# Altium schematic sheet H-Link.SchDoc
size A4
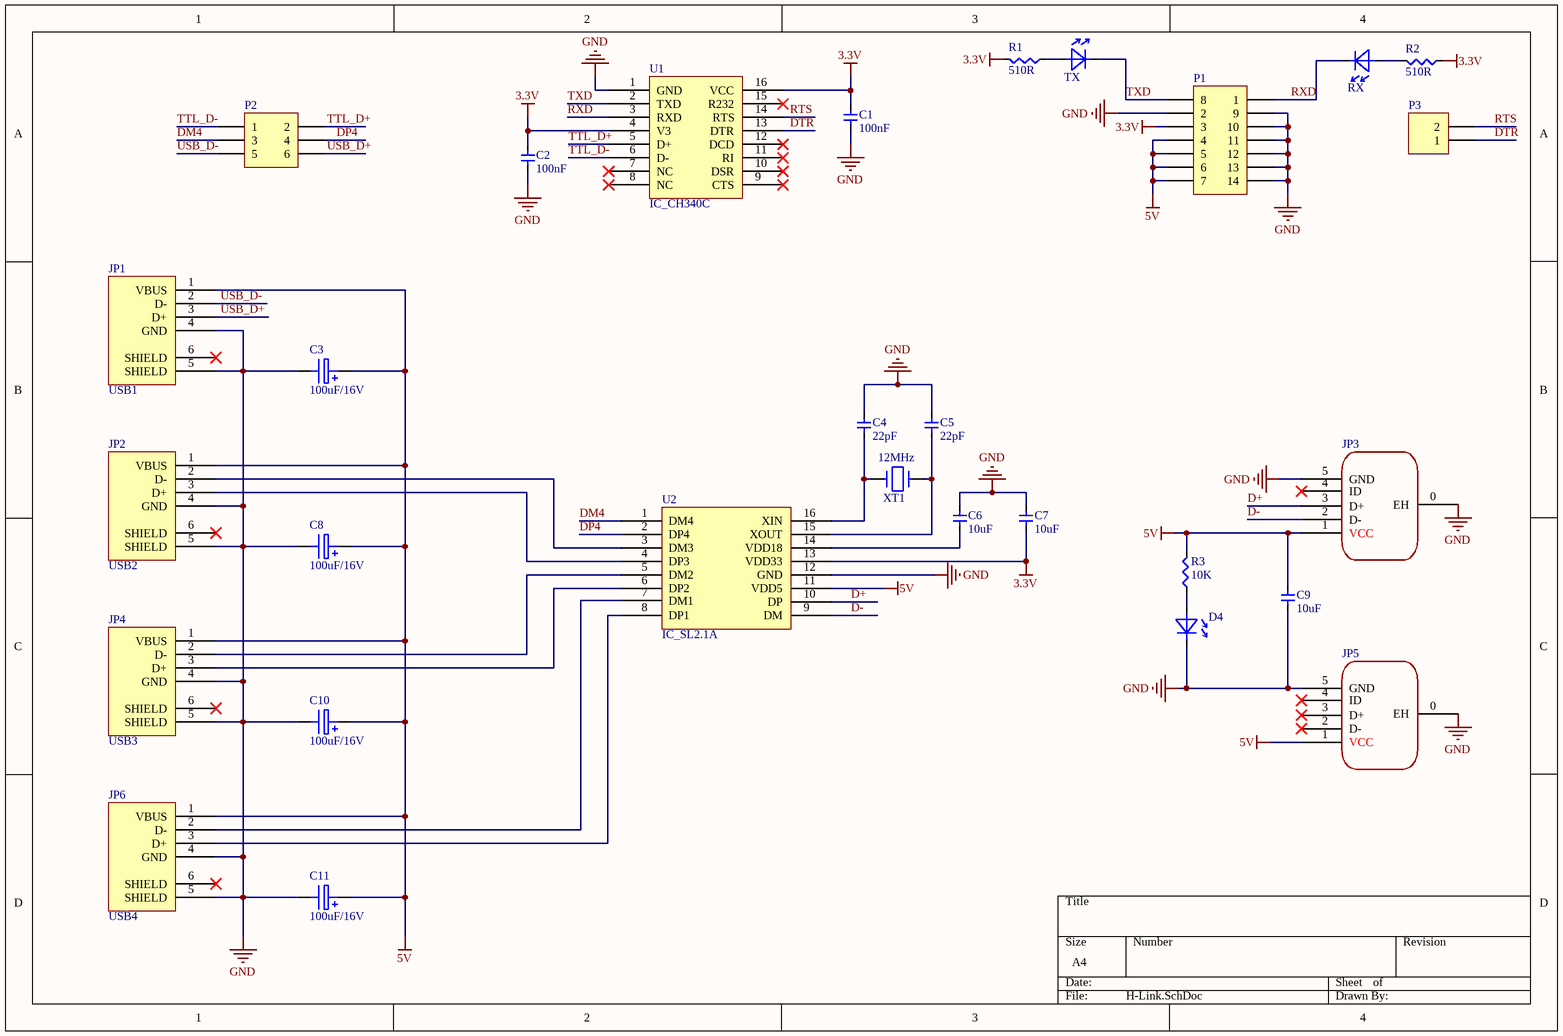
[diagram p0: H-Link.SchDoc]

## Parts
C1  100nF  [C 0603_M]
C2  100nF  [C 0603_M]
C3  100uF/16V  [CT 6*4 - R]
C4  22pF  [C 0603_M]
C5  22pF  [C 0603_M]
C6  10uF  [C 0603_M]
C7  10uF  [C 0603_M]
C8  100uF/16V  [CT 6*4 - R]
C9  10uF  [C 0603_M]
C10  100uF/16V  [CT 6*4 - R]
C11  100uF/16V  [CT 6*4 - R]
D4  DX_LED  [LED 0603G]  (value not drawn)
JP1  USB1  [USB A SMD]
JP2  USB2  [USB A SMD]
JP3  PT_USB_MINI  [USB MINI-5P-90度弯针]  (value not drawn)
JP4  USB3  [USB A SMD]
JP5  PT_USB_MINI  [USB MINI-5P-90度弯针]  (value not drawn)
JP6  USB4  [USB A SMD]
P1  Header 7X2A  [HDR2X7_CEN]  (value not drawn)
P2  Header 3X2  [HDR2X3]  (value not drawn)
P3  Header 2  [HDR1X2]  (value not drawn)
R1  510R  [R 0603_M]
R2  510R  [R 0603_M]
R3  10K  [R 0603_M]
RX  DX_LED  [LED 0603G]  (value not drawn)
TX  DX_LED  [LED 0603G]  (value not drawn)
U1  IC_CH340C  [SOP16]
U2  IC_SL2.1A  [SOP16]
XT1  12MHz  [OSC HC-49S]

## Nets
3.3V: C1.2 C2.2 C7.1 P1.3 R1.2 R2.1 U1.4(V3) U1.16(VCC) U2.13(VDD33)
5V: C3.1(+) C8.1(+) C9.2 C10.1(+) C11.1(+) JP1.1(VBUS) JP2.1(VBUS) JP3.1(VCC) JP4.1(VBUS) JP5.1(VCC) JP6.1(VBUS) P1.4 P1.5 P1.6 P1.7 R3.2 U2.11(VDD5)
GND: C1.1 C2.1 C3.2(-) C4.2 C5.2 C6.2 C7.2 C8.2(-) C9.1 C10.2(-) C11.2(-) D4.K JP1.4(GND) JP1.5(SHIELD) JP2.4(GND) JP2.5(SHIELD) JP3.0(EH) JP3.5(GND) JP4.4(GND) JP4.5(SHIELD) JP5.0(EH) JP5.5(GND) JP6.4(GND) JP6.5(SHIELD) P1.2 P1.9 P1.10 P1.11 P1.12 P1.13 P1.14 U1.1(GND) U2.12(GND)
D+: JP3.3(D+) U2.10(DP)
D-: JP3.2(D-) U2.9(DM)
DM4: P2.3 U2.1(DM4)
DP4: P2.4 U2.2(DP4)
DTR: P3.1 U1.13(DTR)
RTS: P3.2 U1.14(RTS)
RXD: P1.1 RX.K U1.3(RXD)
TTL_D+: P2.2 U1.5(D+)
TTL_D-: P2.1 U1.6(D-)
TXD: P1.8 TX.K U1.2(TXD)
USB_D+: JP1.3(D+) P2.6
USB_D-: JP1.2(D-) P2.5
NetC4_1: C4.1 U2.16(XIN) XT1.2
NetC5_1: C5.1 U2.15(XOUT) XT1.1
NetC6_1: C6.1 U2.14(VDD18)
NetD4_A: D4.A R3.1
NetJP2_2: JP2.2(D-) U2.3(DM3)
NetJP2_3: JP2.3(D+) U2.4(DP3)
NetJP4_2: JP4.2(D-) U2.5(DM2)
NetJP4_3: JP4.3(D+) U2.6(DP2)
NetJP6_2: JP6.2(D-) U2.7(DM1)
NetJP6_3: JP6.3(D+) U2.8(DP1)
NetR1_1: R1.1 TX.A
NetR2_2: R2.2 RX.A

Not connected (* = marked no-connect by the designer): JP1 6(SHIELD)*; JP2 6(SHIELD)*; JP3 4(ID)*; JP4 6(SHIELD)*; JP5 2(D-)* 3(D+)* 4(ID)*; JP6 6(SHIELD)*; U1 7(NC)* 8(NC)* 9(CTS)* 10(DSR)* 11(RI)* 12(DCD)* 15(R232)*

## Library data of the parts
C1 C2 C4-C7 C9 = CX_CAP: 电容
C3 C8 C10 C11 = CC_ELECTOR1: 电解电容
D4 RX TX = DX_LED: 发光二极管
JP1 JP2 JP4 JP6 = PT_USB_A_WX1
P1 = Header 7X2A: Header, 7-Pin, Dual row; LatestRevisionDate: 17-Jul-2002; LatestRevisionNote: Re-released for DXP Platform.; Publisher: Altium Limited
P2 = Header 3X2: Header, 3-Pin, Dual row; LatestRevisionDate: 17-Jul-2002; LatestRevisionNote: Re-released for DXP Platform.; Publisher: Altium Limited
P3 = Header 2: Header, 2-Pin; LatestRevisionDate: 17-Jul-2002; LatestRevisionNote: Re-released for DXP Platform.; Publisher: Altium Limited
R1-R3 = RX_RES: 电阻
U1 = IC_CH340C: USB转串口芯片，内置晶振
U2 = IC_SL2.1A: USB2.0 HUB控制器
XT1 = XT_CRYSTAL2P: 2P晶振